# EAGLE schematic TinyISD1700_V2_2020-08-19-smd-sop-SPI-1206_SPI (EAGLE 7.5.0)
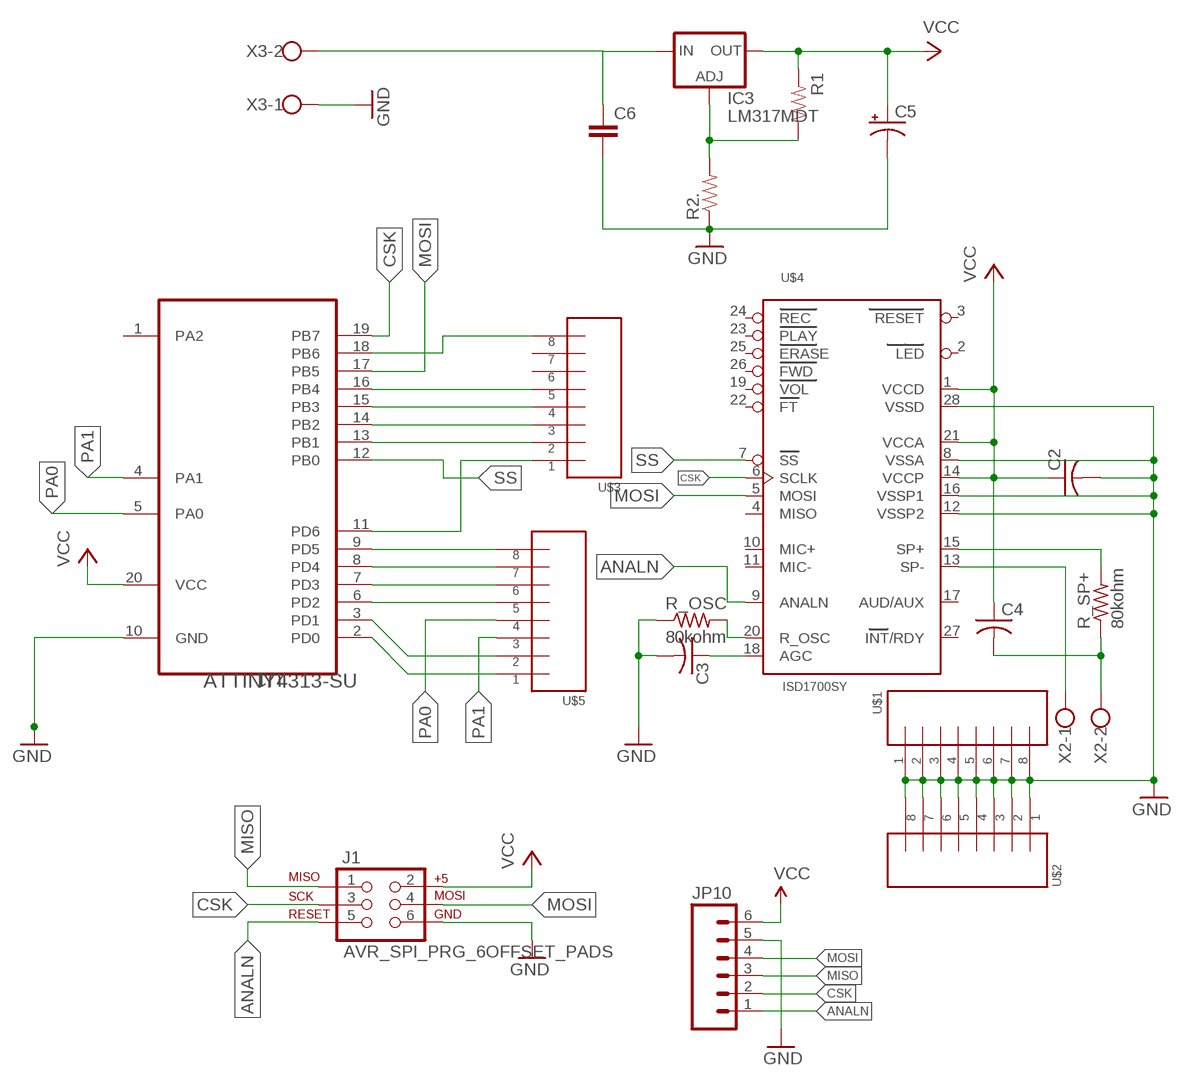
[diagram p0: schematic, sheet 1]

## Parts
C2  C-US050-030X075  [C050-030X075]
C3  C-US050-030X075  [C050-030X075]
C4  C-US050-030X075  [C050-030X075]
C5  CAP_POL1206  [EIA3216]
C6  CAP0805  [0805]
IC3  LM317MDT  [DPACK]
J1  AVR_SPI_PRG_6OFFSET_PADS  [2X3_OFFSET]
JP10  M06SIP  [1X06]
R1  RESISTOR  [0805]
R2.  RESISTOR  [0805]
R_OSC  80kohm  R-US_0204/2V  [0204V]
R_SP+  80kohm  R-US_0204/2V  [0204V]
U1  ATTINY4313-SU  [SOIC127P1032X265-20N]
U$1  8PIN_HEADER  [8PIN_HEADER]
U$2  8PIN_HEADER  [8PIN_HEADER]
U$3  8PIN_HEADER  [8PIN_HEADER]
U$4  ISD1700SY  [SO28W]
U$5  8PIN_HEADER  [8PIN_HEADER]
X2  W237-102  [W237-102]
X3  W237-102  [W237-102]

## Nets
ANALN: J1.5 JP10.1 U$4.9(ANALN)
CSK: J1.3 JP10.2 U1.19(PB7) U$4.6(SCLK)
GND: C2.2 C3.2 C5.C(-) C6.2 J1.6 JP10.5 R2..1 R_OSC.1 U1.10(GND) U$1.P$1 U$1.P$2 U$1.P$3 U$1.P$4 U$1.P$5 U$1.P$6 U$1.P$7 U$1.P$8 U$2.P$1 U$2.P$2 U$2.P$3 U$2.P$4 U$2.P$5 U$2.P$6 U$2.P$7 U$2.P$8 U$4.8(VSSA) U$4.12(VSSP2) U$4.16(VSSP1) U$4.28(VSSD) X3.1
MISO: J1.1 JP10.3
MOSI: J1.4 JP10.4 U1.17(PB5) U$4.5(MOSI)
N$1: R_OSC.2 U$4.20(R_OSC)
N$2: U1.13(PB1) U$3.P$2
N$3: U1.14(PB2) U$3.P$3
N$4: C4.2 R_SP+.1 X2.2
N$5: C3.1 U$4.18(AGC)
N$6: U$4.13(SP-) X2.1
N$7: R_SP+.2 U$4.15(SP+)
N$8: U1.15(PB3) U$3.P$4
N$9: U1.11(PD6) U$3.P$1
N$11: U1.9(PD5) U$5.P$8
N$12: U1.8(PD4) U$5.P$7
N$13: U1.7(PD3) U$5.P$6
N$14: U1.6(PD2) U$5.P$5
N$15: U1.3(PD1) U$5.P$2
N$16: U1.2(PD0) U$5.P$1
N$20: U1.16(PB4) U$3.P$5
N$28: C6.1 IC3.3(IN) X3.2
N$29: IC3.1(ADJ) R1.1 R2..2
PA0: U1.5(PA0) U$5.P$4
PA1: U1.4(PA1) U$5.P$3
Q: U1.18(PB6) U$3.P$8
SS: U1.12(PB0) U$4.7(SS)
VCC: C2.1 C4.1 C5.A(+) IC3.4(OUT) J1.2 JP10.6 R1.2 U1.20(VCC) U$4.1(VCCD) U$4.14(VCCP) U$4.21(VCCA)
Unconnected: U1.1(PA2) U$3.P$6 U$3.P$7 U$4.2(LED) U$4.3(RESET) U$4.4(MISO) U$4.10(MIC+) U$4.11(MIC-) U$4.17(AUD/AUX) U$4.19(VOL) U$4.22(FT) U$4.23(PLAY) U$4.24(REC) U$4.25(ERASE) U$4.26(FWD) U$4.27(INT/RDY)

## Library data of the parts
C2-C4 = resistor:C-US: CAPACITOR, American symbol; OC_FARNELL: unknown
C5 = SparkFun2:CAP_POL: Capacitor Polarized These are standard SMD and PTH capacitors. Normally 10uF, 47uF, and 100uF in electrolytic and tantalum varieties. Always verify the external diameter of the through hole cap, it varies with capacity, voltage, and manufacturer. The EIA devices should be standard.
C6 = SparkFun2:CAP: Capacitor Standard 0603 ceramic capacitor, and 0.1" leaded capacitor.
IC3 = v-reg:LM317?*: 500 mA Adjustable Output Positive Voltage Regulator Source: http://www.onsemi.co.jp .. LM317M-D.PDF
J1 = SparkFun:AVR_SPI_PRG_6: AVR ISP 6 Pin This is the reduced ISP connector for AVR programming. Common on Arduino. This footprint will take up less PCB space and can be used with a 10-pin to 6-pin adapter such as SKU: BOB-08508
JP10 = SparkFun-Connectors:M06: Header 6 Standard 6-pin 0.1" header. Use with straight break away headers (SKU : PRT-00116), right angle break away headers (PRT-00553), swiss pins (PRT-00743), machine pins (PRT-00117), and female headers (PRT-00115). Molex polarized connector foot print use with SKU : PRT-08094 with associated crimp pins and housings. NOTES ON THE VARIANTS LOCK and LOCK_LONGPADS... This footprint was designed to help hold the alignment of a through-hole component (i.e. 6-pin header) while soldering it into place. You may notice that each hole has been shifted either up or down by 0.005 of an inch from it's more standard position (which is a perfectly straight line). This slight alteration caused the pins (the squares in the middle) to touch the edges of the holes. Because they are alternating, it causes a "brace" to hold the component in place. 0.005 has proven to be the perfect amount of "off-center" position when using our standard breakaway headers. Although looks a little odd when you look at the bare footprint, once you have a header in there, the alteration is very hard to notice. Also, if you push a header all the way into place, it is covered up entirely on the bottom side. This idea of altering the position of holes to aid alignment will be further integrated into the Sparkfun Library for other footprints. It can help hold any component with 3 or more connection pins.
R1 R2. = SparkFun:RESISTOR: Resistor Basic schematic elements and footprints for 0603, 1206, and PTH 1/10th watt (small) resistors.
R_OSC R_SP+ = rcl:R-US_: RESISTOR, American symbol; OC_FARNELL: unknown
U1 = Atmel_By_element14_Batch_1-00:ATTINY4313-SU: 8-bit Microcontroller with In-System Programmable Flash; MF: MICROCHIP; MPN: ATTINY4313-SU; OC_FARNELL: 1841621; OC_NEWARK: 12T1340; PACKAGE: SOIC-20; SUPPLIER: Atmel
U$1-U$3 U$5 = arduino:8PIN_HEADER; MF: RENESAS; MPN: YSDKS128E10; OC_FARNELL: 2946736
U$4 = isd-new-1:ISD1700; OC_FARNELL: unknown
X2 X3 = con-wago-500:W237-102: WAGO SCREW CLAMP; OC_FARNELL: unknown; OC_NEWARK: 70K9898